# Altium schematic sheet Current Sense.SchDoc: Current Sense
size A3; Engineer: A. SHAW; Organization: BLUEsat Project; Address1: Room 419; Address2: School of EE&T; Address3: UNSW, NSW 2052; Address4: Australia; DocumentNumber: TELM0004; SheetNumber: 1; SheetTotal: 1; Description: Converts Current to Voltage 500mV/A; Version: 1.0
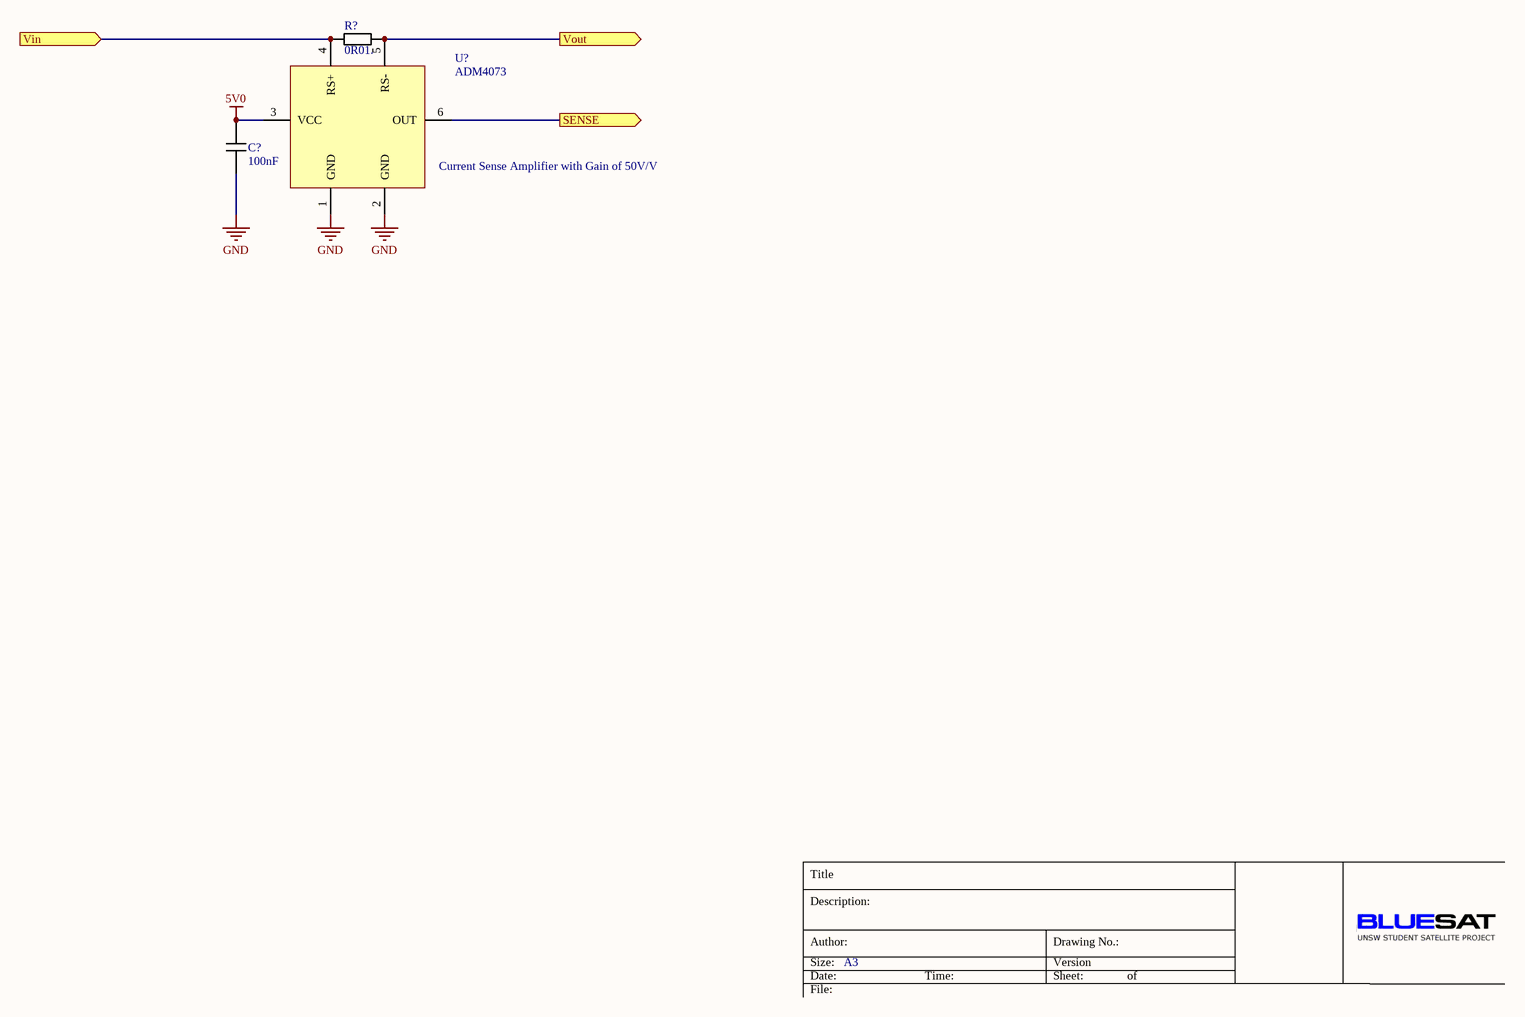
[diagram p0: Current Sense.SchDoc]

## Parts
C?  value 100nF  [0603 Cap]  (hidden comment: 0603 Cap)
R?  value 0R01.  [0603 Resistor]  (hidden comment: 0603 Resistor)
U?  ADM4073

## Ports
SENSE (out), Vin (in), Vout (out)

## Nets
5V0: C?.2 U?.3(VCC)
GND: C?.1 U?.1(GND) U?.2(GND)
SENSE: U?.6(OUT) ; port SENSE
Vin: R?.1 U?.4(RS+) ; port Vin
Vout: R?.2 U?.5(RS-) ; port Vout

## Notes on the sheet
- (near U?) Current Sense Amplifier with Gain of 50V/V
- Title
- Description:
- Size:
- Author:
- Date:
- A3
- Time:
- Version
- Sheet:
- Drawing No.:
- of
- File:

## Library data of the parts
C? = 0603 MLCC - X7R, 10%
R? = 0603 Thin Film Resistor 0.1%
U? = ADM4073: Current Sense Amplifer